# Altium schematic sheet HDMI_SWITCH.SchDoc
size A; SheetNumber: 5; SheetTotal: 12
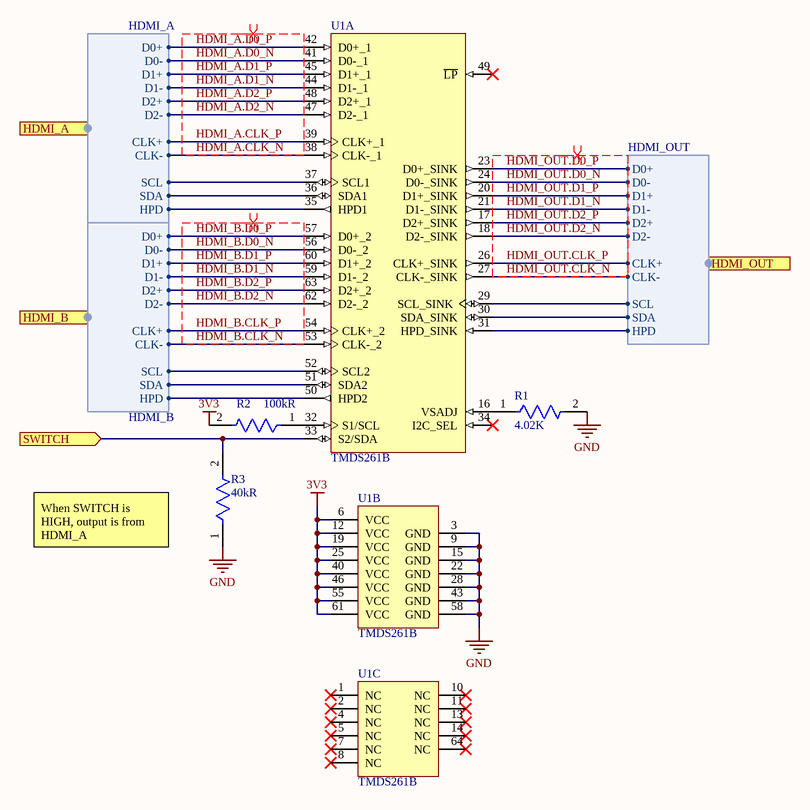
[diagram p0: HDMI_SWITCH.SchDoc]

## Parts
R1  value 4.02K  [FP-RT0402-MFG]  (hidden comment: RT0402)
R2  Resistance: 100kR  [FP-RK73H1J-IPC_C]  (hidden comment: RK73H1JLTD1003F)
R3  Resistance: 40kR  [FP-CRCW0805-e3-MFG]  (hidden comment: CRCW080540K0FKEA)
U1  TMDS261B  [PAG0064A_N]  (parts A,B,C of 3)

## Ports
HDMI_A (harness HDMI_A, see HDMI[2B], HDMI_IN[2B]), HDMI_B (harness HDMI_B, see HDMI[2B], HDMI_IN[4B]), HDMI_OUT (harness HDMI_OUT, see HDMI[3B], HDMI_OUT[2B]), SWITCH (in, see HDMI[2B], SWITCH[4B], USB[2C], USB_SWITCH_A[1B], USB_SWITCH_B[1B])

## Harnesses
HDMI_A: SCL, SDA, HPD, D0+, D0-, D1+, D1-, D2+, D2-, CLK+, CLK-
HDMI_B: SCL, SDA, HPD, D0+, D0-, D1+, D1-, D2+, D2-, CLK+, CLK-
HDMI_OUT: SCL, SDA, HPD, D0+, D0-, D1+, D1-, D2+, D2-, CLK+, CLK-

## Nets
3V3: R2.2 U1.6(VCC) U1.12(VCC) U1.19(VCC) U1.25(VCC) U1.40(VCC) U1.46(VCC) U1.55(VCC) U1.61(VCC)
GND: R1.2 R3.1 U1.3(GND) U1.9(GND) U1.15(GND) U1.22(GND) U1.28(GND) U1.43(GND) U1.58(GND)
HDMI_A.CLK_N: U1.38(CLK-_1) ; port HDMI_A.CLK-
HDMI_A.CLK_P: U1.39(CLK+_1) ; port HDMI_A.CLK+
HDMI_A.D0_N: U1.41(D0-_1) ; port HDMI_A.D0-
HDMI_A.D0_P: U1.42(D0+_1) ; port HDMI_A.D0+
HDMI_A.D1_N: U1.44(D1-_1) ; port HDMI_A.D1-
HDMI_A.D1_P: U1.45(D1+_1) ; port HDMI_A.D1+
HDMI_A.D2_N: U1.47(D2-_1) ; port HDMI_A.D2-
HDMI_A.D2_P: U1.48(D2+_1) ; port HDMI_A.D2+
HDMI_B.CLK_N: U1.53(CLK-_2) ; port HDMI_B.CLK-
HDMI_B.CLK_P: U1.54(CLK+_2) ; port HDMI_B.CLK+
HDMI_B.D0_N: U1.56(D0-_2) ; port HDMI_B.D0-
HDMI_B.D0_P: U1.57(D0+_2) ; port HDMI_B.D0+
HDMI_B.D1_N: U1.59(D1-_2) ; port HDMI_B.D1-
HDMI_B.D1_P: U1.60(D1+_2) ; port HDMI_B.D1+
HDMI_B.D2_N: U1.62(D2-_2) ; port HDMI_B.D2-
HDMI_B.D2_P: U1.63(D2+_2) ; port HDMI_B.D2+
HDMI_OUT.CLK_N: U1.27(CLK-_SINK) ; port HDMI_OUT.CLK-
HDMI_OUT.CLK_P: U1.26(CLK+_SINK) ; port HDMI_OUT.CLK+
HDMI_OUT.D0_N: U1.24(D0-_SINK) ; port HDMI_OUT.D0-
HDMI_OUT.D0_P: U1.23(D0+_SINK) ; port HDMI_OUT.D0+
HDMI_OUT.D1_N: U1.21(D1-_SINK) ; port HDMI_OUT.D1-
HDMI_OUT.D1_P: U1.20(D1+_SINK) ; port HDMI_OUT.D1+
HDMI_OUT.D2_N: U1.18(D2-_SINK) ; port HDMI_OUT.D2-
HDMI_OUT.D2_P: U1.17(D2+_SINK) ; port HDMI_OUT.D2+
SWITCH: R3.2 U1.33(S2/SDA) ; port SWITCH
NetR1_1: R1.1 U1.16(VSADJ)
NetR2_1: R2.1 U1.32(S1/SCL)
NetU1_29: U1.29(SCL_SINK) ; port HDMI_OUT.SCL
NetU1_30: U1.30(SDA_SINK) ; port HDMI_OUT.SDA
NetU1_31: U1.31(HPD_SINK) ; port HDMI_OUT.HPD
NetU1_35: U1.35(HPD1) ; port HDMI_A.HPD
NetU1_36: U1.36(SDA1) ; port HDMI_A.SDA
NetU1_37: U1.37(SCL1) ; port HDMI_A.SCL
NetU1_50: U1.50(HPD2) ; port HDMI_B.HPD
NetU1_51: U1.51(SDA2) ; port HDMI_B.SDA
NetU1_52: U1.52(SCL2) ; port HDMI_B.SCL

Not connected (* = marked no-connect by the designer): U1 1(NC)* 2(NC)* 4(NC)* 5(NC)* 7(NC)* 8(NC)* 10(NC)* 11(NC)* 13(NC)* 14(NC)* 34(I2C_SEL)* 49(~{LP})* 64(NC)*

## Layout directives
differential pair: HDMI_A.CLK_N, HDMI_A.CLK_P, HDMI_A.D0_N, HDMI_A.D0_P, HDMI_A.D1_N, HDMI_A.D1_P, HDMI_A.D2_N, HDMI_A.D2_P, HDMI_B.CLK_N, HDMI_B.CLK_P, HDMI_B.D0_N, HDMI_B.D0_P, HDMI_B.D1_N, HDMI_B.D1_P, HDMI_B.D2_N, HDMI_B.D2_P, HDMI_OUT.CLK_N, HDMI_OUT.CLK_P, HDMI_OUT.D0_N, HDMI_OUT.D0_P, HDMI_OUT.D1_N, HDMI_OUT.D1_P, HDMI_OUT.D2_N, HDMI_OUT.D2_P

## Notes on the sheet
- When SWITCH is HIGH, output is from HDMI_A

## Library data of the parts
R1 = RT0402: RT0402 4.02KΩ 0.063W 50 ppm/°C 1.00%
R2 = CMP-04015-074272-1: 100kΩ ±1% 0.1W Chip Resistor 0603 Thick Film AEC-Q200 Qualified; Temperature Coefficient: 100ppm/°C; Power Rating: 100mW; Voltage Rating: 50V; Series: RK73H; Case/Package: 0603; Max Operating Temperature: 155°C; Case Code (Imperial): 0603; Length: 1.6mm; Package Quantity: 5000; Min Operating Temperature: -55°C; Tolerance: 1%; Termination: SMD/SMT; Packaging: Tape and Reel; Case Code (Metric): 1608; Height: 0.45mm; Width: 0.8mm; Lead Free: Contains Lead
R3 = CMP-02407-003498-1: RES Thick Film, 40kΩ, 1%, 0.125W, 100ppm/°C, 0805; Max Power Dissipation: 125mW; Tolerance: 1%; Features: Automotive AEC-Q200; Max Operating Temperature: 155°C; Composition: Thick Film; Length: 0.079inch; Case/Package: 0805; Min Operating Temperature: -55°C; Packaging: Tape and Reel; Number of Terminations: 2; Width: 0.049inch; Height: 0.02inch; Package Quantity: 5000; Lead Free: Lead Free; Temperature Coefficient: 100ppm/°C
U1 = TMDS261B: 3-Gbps 2-to-1 HDMI/DVI mux with adaptive equalization 64-TQFP 0 to 70